# EAGLE schematic Power (EAGLE 9.6.2)
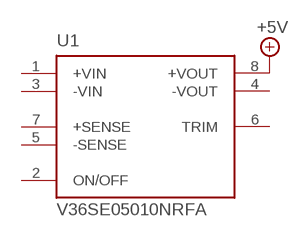
[diagram p0: schematic, sheet 1]

## Parts
U1  V36SE05010NRFA  [MODULE_V36SE05010NRFA]

## Nets
+5V: U1.8(+VOUT)
Unconnected: U1.1(+VIN) U1.2(ON/OFF) U1.3(-VIN) U1.4(-VOUT) U1.5(-SENSE) U1.6(TRIM) U1.7(+SENSE)

## Library data of the parts
U1 = SnapEDA Library:V36SE05010NRFA: 16th brick 5V 10A; MANUFACTURER: Delta Electronics; MAXIMUM_PACKAGE_HEIGHT: 9.80mm; PARTREV: 03282018; STANDARD: IPC 7351B